# EAGLE design avr-grundschaltung (EAGLE 4.16)
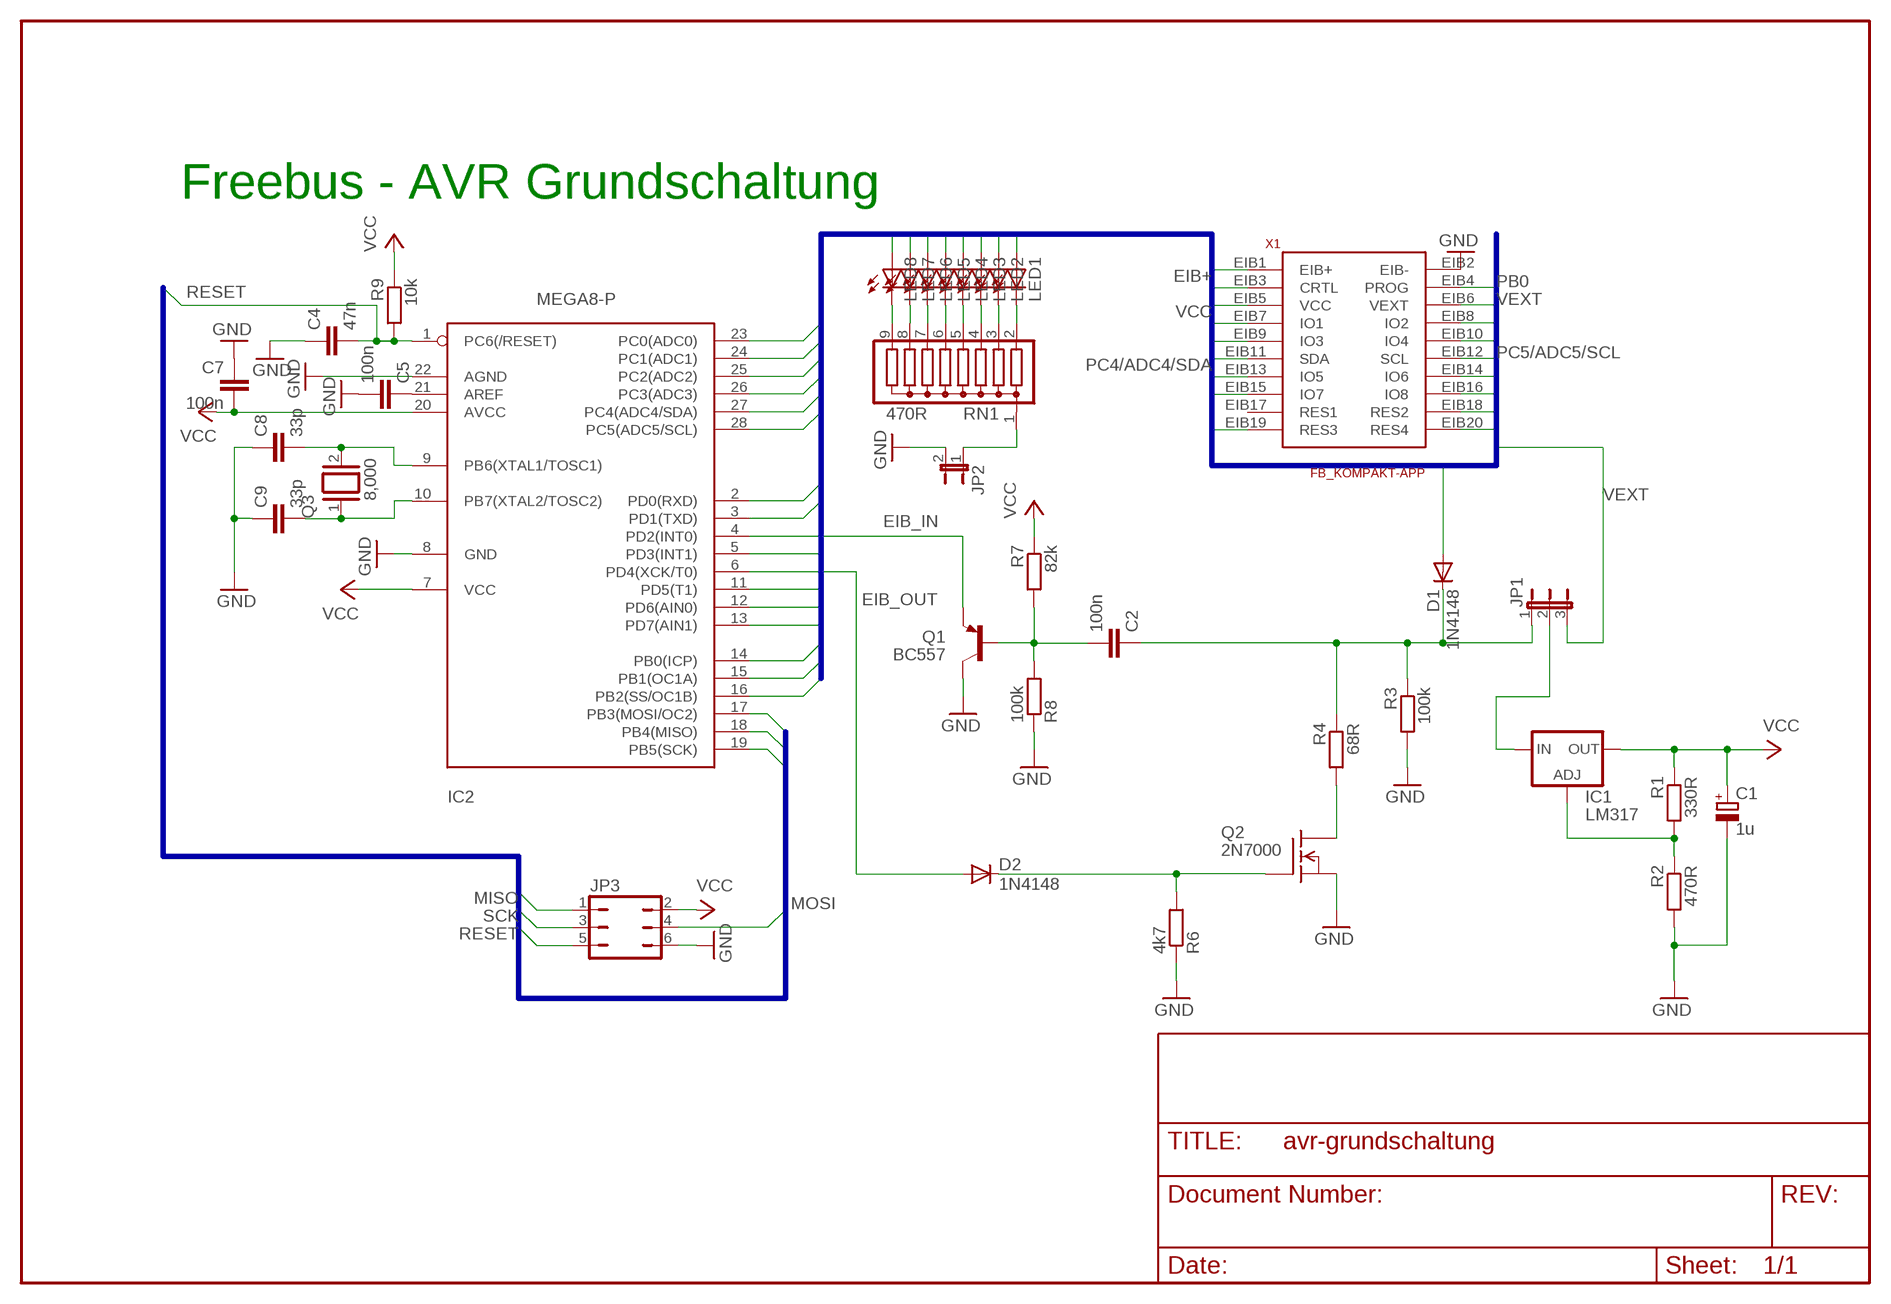
[diagram p0: schematic, sheet 1]

## Parts
C1  1u  CPOL-EUE2-5  [E2-5]
C2  100n  C-EU050-025X075  [C050-025X075]
C4  47n  C-EU050-024X044  [C050-024X044]
C5  100n  C-EU050-025X075  [C050-025X075]
C7  100n  C-EU050-025X075  [C050-025X075]
C8  33p  C-EU025-025X050  [C025-025X050]
C9  33p  C-EU025-025X050  [C025-025X050]
D1  1N4148  [DO35-10]
D2  1N4148  [DO35-10]
IC1  LM317  LM317L  [317L]
IC2  MEGA8-P  [DIL28-3]
JP1  JP2E  [JP2]
JP2  JP1E  [JP1]
JP3  JP3Q  [JP3Q]
LED1  LED3MM  [LED3MM]
LED2  LED3MM  [LED3MM]
LED3  LED3MM  [LED3MM]
LED4  LED3MM  [LED3MM]
LED5  LED3MM  [LED3MM]
LED6  LED3MM  [LED3MM]
LED7  LED3MM  [LED3MM]
LED8  LED3MM  [LED3MM]
Q1  BC557  [TO92]
Q2  2N7000  VN2222KM  [TO237]
Q3  8,000  XTAL/S  [QS]
R1  330R  R-EU_0207/10  [0207/10]
R2  470R  R-EU_0207/10  [0207/10]
R3  100k  R-EU_0207/10  [0207/10]
R4  68R  R-EU_0207/10  [0207/10]
R6  4k7  R-EU_0207/10  [0207/10]
R7  82k  R-EU_0207/10  [0207/10]
R8  100k  R-EU_0207/10  [0207/10]
R9  10k  R-EU_0207/10  [0207/10]
RN1  470R  G08R  [SIL9]
X1  FB_KOMPAKT-APP  [EIB_10X2_STECKER]

## Nets
EIB+: D1.A X1.EIB1(EIB+)
EIB_IN: IC2.4(PD2(INT0)) Q1.1(E)
EIB_OUT: D2.A IC2.6(PD4(XCK/T0))
GND: C1.- C4.1 C5.2 C7.1 C8.1 C9.1 IC2.8(GND) IC2.22(AGND) JP2.2 JP3.6 Q1.3(C) Q2.3(S) R2.2 R3.2 R6.1 R8.1 X1.EIB2(EIB-)
MISO: IC2.18(PB4(MISO)) JP3.1
MOSI: IC2.17(PB3(MOSI/OC2)) JP3.4
N$1: D2.C Q2.2(G) R6.2
N$2: IC1.1(ADJ) R1.2 R2.1
N$3 [supply]: C2.1 D1.C JP1.1 R3.1 R4.1
N$4: LED8.K(C) RN1.9
N$5 [supply]: Q2.1(D) R4.2
N$6 [supply]: IC1.3(IN) JP1.2
N$7 [supply]: C2.2 Q1.2(B) R7.2 R8.2
N$8: C8.2 IC2.9(PB6(XTAL1/TOSC1)) Q3.2
N$9: C9.2 IC2.10(PB7(XTAL2/TOSC2)) Q3.1
N$10: LED7.K(C) RN1.8
N$11: LED6.K(C) RN1.7
N$13: LED5.K(C) RN1.6
N$14: LED4.K(C) RN1.5
N$15: LED3.K(C) RN1.4
N$16: LED2.K(C) RN1.3
N$17: LED1.K(C) RN1.2
N$18: JP2.1 RN1.1
N$24: C5.1 IC2.21(AREF)
PB0: IC2.14(PB0(ICP)) X1.EIB4(PROG)
PB1/OC1A/PWM1: IC2.15(PB1(OC1A)) X1.EIB3(CRTL)
PB2/OC1B/PWM2: IC2.16(PB2(SS/OC1B)) X1.EIB19(RES3)
PC0/ADC0: IC2.23(PC0(ADC0)) X1.EIB18(RES2)
PC1/ADC1: IC2.24(PC1(ADC1)) X1.EIB20(RES4)
PC2/ADC2: IC2.25(PC2(ADC2)) LED7.A X1.EIB15(IO7)
PC3/ADC3: IC2.26(PC3(ADC3)) LED8.A X1.EIB16(IO8)
PC4/ADC4/SDA: IC2.27(PC4(ADC4/SDA)) X1.EIB11(SDA)
PC5/ADC5/SCL: IC2.28(PC5(ADC5/SCL)) X1.EIB12(SCL)
PD0/RXD: IC2.2(PD0(RXD)) LED1.A X1.EIB7(IO1)
PD1/TXD: IC2.3(PD1(TXD)) LED2.A X1.EIB8(IO2)
PD3/INT1: IC2.5(PD3(INT1)) LED3.A X1.EIB9(IO3)
PD5/T1: IC2.11(PD5(T1)) LED4.A X1.EIB10(IO4)
PD6/AIN0: IC2.12(PD6(AIN0)) LED5.A X1.EIB13(IO5)
PD7/AIN1: IC2.13(PD7(AIN1)) LED6.A X1.EIB14(IO6)
RESET: C4.2 IC2.1(PC6(/RESET)) JP3.5 R9.2
SCK: IC2.19(PB5(SCK)) JP3.3
VCC: C1.+ C7.2 IC1.2(OUT) IC2.7(VCC) IC2.20(AVCC) JP3.2 R1.1 R7.1 R9.1 X1.EIB5(VCC)
VEXT [supply]: JP1.3 X1.EIB6(VEXT)
Unconnected: X1.EIB17(RES1)

## Buses
PC0/ADC0,PC1/ADC1,PC2/ADC2,PC3/ADC3,PC4/ADC4/SDA,PC5/ADC5/SCL,PD0/RXD,PD1/TXD,EIB+,PB1/OC1A/PWM1,PB2/OC1B/PWM2,VEXT,PB0,VCC,PD3/INT1,PD5/T1,PD6/AIN0,PD7/AIN1
MOSI,MISO,SCK,RESET

## Notes on the sheet
- Freebus - AVR Grundschaltung

## Library data of the parts
C1 = rcl:CPOL-EU: POLARIZED CAPACITOR, European symbol
C2 C4 C5 C7-C9 = rcl:C-EU: CAPACITOR, European symbol
D1 D2 = diode:1N4148: DIODE high speed (Philips)
IC1 = v-reg:LM317L: VOLTAGE REGULATOR
IC2 = atmel:MEGA8-P: MICROCONTROLLER 8 Kbytes FLASH 1 kbytes SRAM 512 bytes EEPROM USART 4-channel 10 bit ADC 2-channel 8 bit ADC Source: avr.lbr
JP1 = jumper:JP2E: JUMPER
JP2 = jumper:JP1E: JUMPER
JP3 = jumper:JP3Q: JUMPER
LED1-LED8 = led:LED: LED OSRAM: - CHIPLED LG R971, LG N971, LY N971, LG Q971, LY Q971, LO R971, LY R971 LH N974, LH R974 LS Q976, LO Q976, LY Q976 LO Q996 - Hyper CHIPLED LW Q18S LB Q993, LB Q99A, LB R99A - SideLED LS A670, LO A670, LY A670, LG A670, LP A670 LB A673, LV A673, LT A673, LW A673 LH A674 LY A675 LS A676, LA A676, LO A676, LY A676, LW A676 LS A679, LY A679, LG A679 - Hyper Micro SIDELED® LS Y876, LA Y876, LO Y876, LY Y876 LT Y87S - SmartLED LW L88C, LW L88S LB L89C, LB L89S, LG L890 LS L89K, LO L89K, LY L89K LS L896, LA L896, LO L896, LY L896 - TOPLED LS T670, LO T670, LY T670, LG T670, LP T670 LSG T670, LSP T670, LSY T670, LOP T670, LYG T670 LG T671, LOG T671, LSG T671 LB T673, LV T673, LT T673, LW T673 LH T674 LS T676, LA T676, LO T676, LY T676, LB T676, LH T676, LSB T676, LW T676 LB T67C, LV T67C, LT T67C, LS T67K, LO T67K, LY T67K, LW E67C LS E67B, LA E67B, LO E67B, LY E67B, LB E67C, LV E67C, LT E67C LW T67C LS T679, LY T679, LG T679 LS T770, LO T770, LY T770, LG T770, LP T770 LB T773, LV T773, LT T773, LW T773 LH T774 LS E675, LA E675, LY E675, LS T675 LS T776, LA T776, LO T776, LY T776, LB T776 LHGB T686 LT T68C, LB T68C - Hyper Mini TOPLED® LB M676 - Mini TOPLED Santana® LG M470 LS M47K, LO M47K, LY M47K Source: http://www.osram.convergy.de - LUMILED® LXK2-PW12-R00, LXK2-PW12-S00, LXK2-PW14-U00, LXK2-PW14-V00 LXK2-PM12-R00, LXK2-PM12-S00, LXK2-PM14-U00 LXK2-PE12-Q00, LXK2-PE12-R00, LXK2-PE12-S00, LXK2-PE14-T00, LXK2-PE14-U00 LXK2-PB12-K00, LXK2-PB12-L00, LXK2-PB12-M00, LXK2-PB14-N00, LXK2-PB14-P00, LXK2-PB14-Q00 LXK2-PR12-L00, LXK2-PR12-M00, LXK2-PR14-Q00, LXK2-PR14-R00 LXK2-PD12-Q00, LXK2-PD12-R00, LXK2-PD12-S00 LXK2-PH12-R00, LXK2-PH12-S00 LXK2-PL12-P00, LXK2-PL12-Q00, LXK2-PL12-R00 Source: www.luxeon.com
Q1 = transistor-pnp:BC557: PNP Transistor
Q2 = transistor-fet:VN2222KM: N-Channel Enhancement MOSFET (VMOS); 60V; 0,5A; 7,5Ohm
Q3 = special:XTAL/S: CRYSTAL
R1-R4 R6-R9 = rcl:R-EU_: RESISTOR, European symbol
RN1 = resistor-sil:G08R: SIL RESISTOR
X1 = EIB_Freebus:FB_KOMPAKT: Steckverbinder für Controller <--> Anwendung Kompaktversion Vorteile: - Das Symbol im Schaltplan sieht so aus wie auf dem PCB - Vielleicht schneller zu überblicken, was an welchem Pin angeschlossen ist Nachteile: - Viele unnötige Leitungen im Schaltplan notwendig

## Net classes
0 default: width 0.406 mm
1 supply: width 0.406 mm

## Board
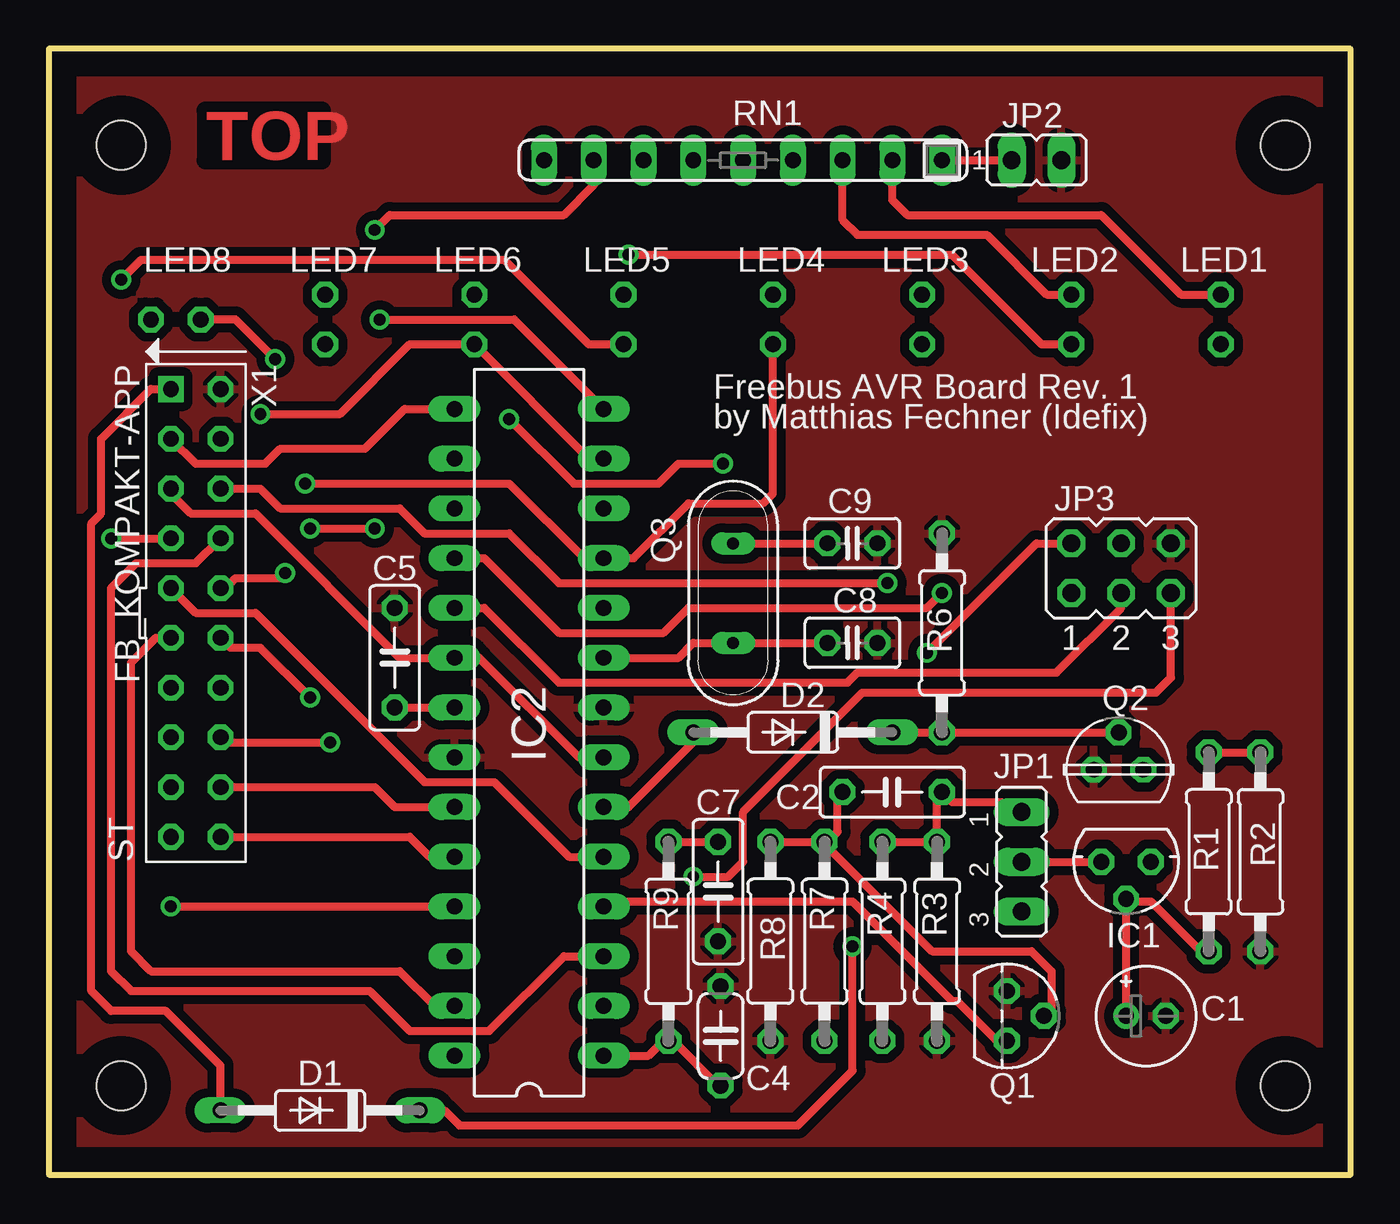
[diagram p1: board, top side]
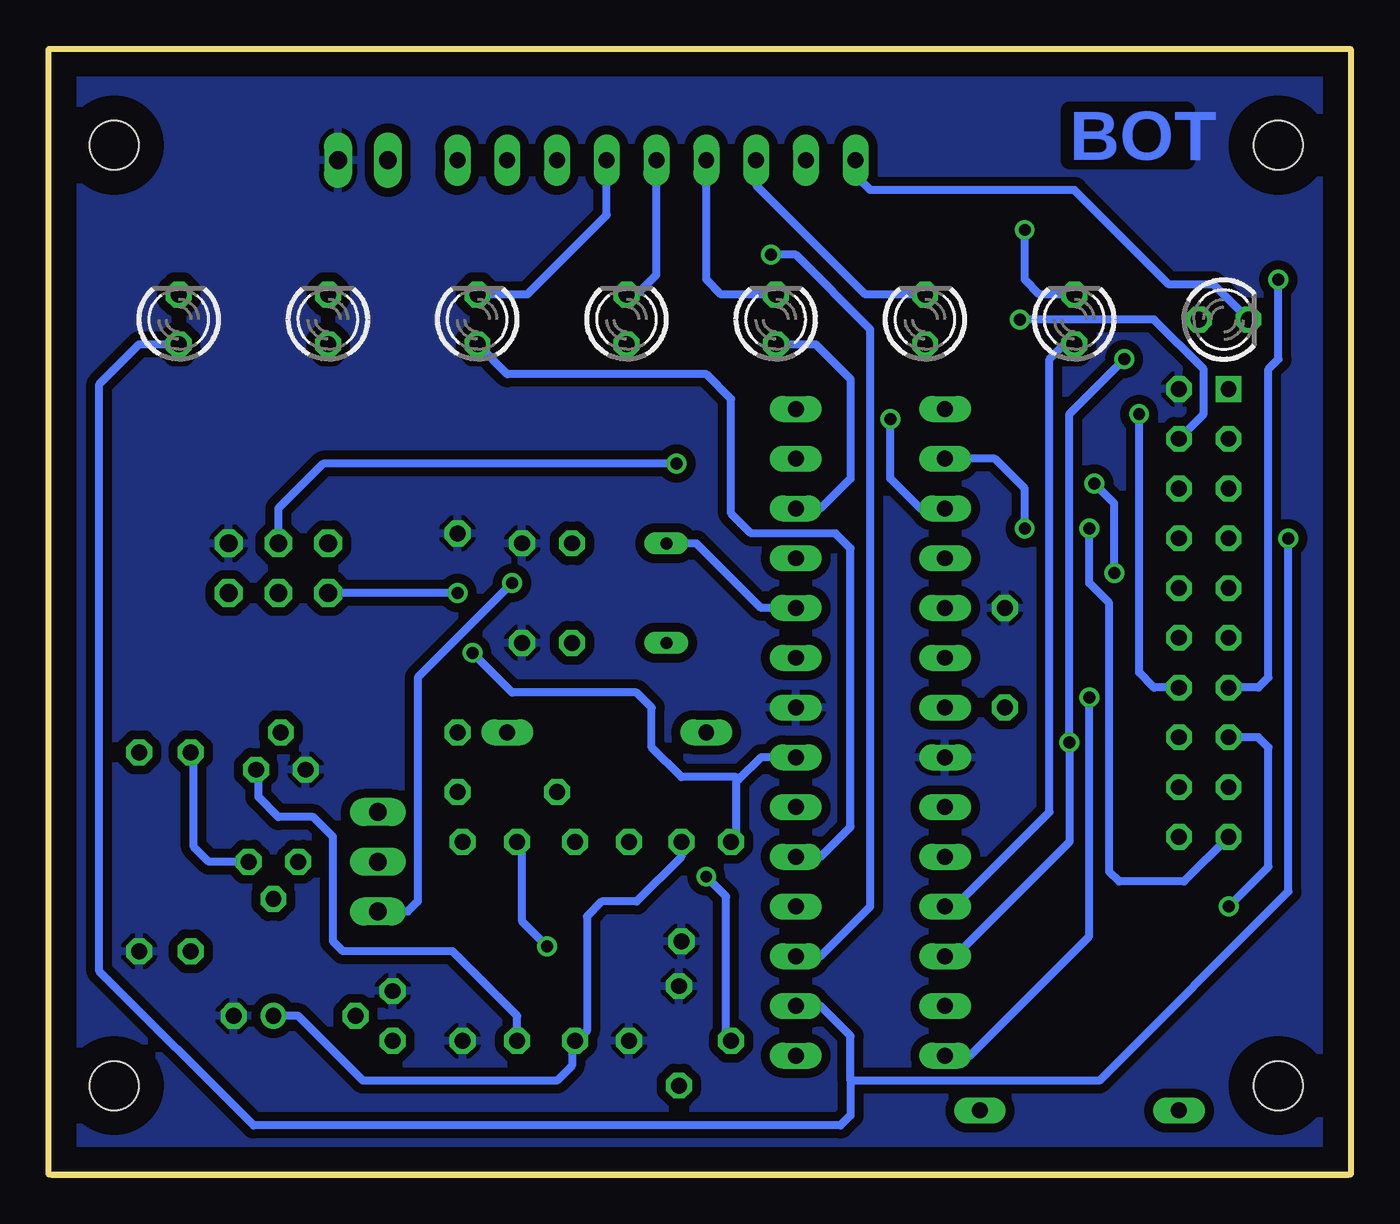
[diagram p2: board, bottom side, seen from below]

Size 66.45 x 57.47 mm. Coordinates in mm from the lower left corner, seen from the top.
Outline: 0,57.47 0,0 66.45,0 66.45,57.47 0,57.47
Copper layers (1*16): Top 0.035mm / dielectric 1.5mm / Bottom 0.035mm
Design rules "idefix-default": minimum track width 10mil, minimum drill 24mil, track to track 18mil, track to pad 12mil, pad to pad 8mil, via to via 50mil, smd to smd 8mil, copper to edge 50mil, drill to drill 50mil, minimum pad ring 10mil, minimum via ring 8mil, stop-mask expansion 4mil, vias tented up to drill 0mil, thermal gap 10mil
Holes 2.5 mm at 3.68,4.54 3.68,52.55 63.12,4.54 63.12,52.55
Milling: 4 lines

### Footprints (pad centres in the part's own frame; a part is rotated, then mirrored left to right if it is on the bottom)
E2-5 = drill 0.813 pad 1.27 round: + -1.016,0 | drill 0.813 pad 1.27 octagon: - 1.016,0
C050-025X075 = drill 0.813 octagon: 1 -2.54,0; 2 2.54,0
C050-024X044 = drill 0.813 octagon: 1 -2.54,0; 2 2.54,0
C025-025X050 = drill 0.813 octagon: 1 -1.27,0; 2 1.27,0
DO35-10 = drill 0.813 long: A 5.08,0; C -5.08,0
317L = drill 0.813 octagon: 1 -1.27,0; 2 0,1.905; 3 1.27,0
DIL28-3 = drill 0.813 long: 1 -16.51,-3.81; 2 -13.97,-3.81; 3 -11.43,-3.81; 4 -8.89,-3.81; 5 -6.35,-3.81; 6 -3.81,-3.81; 7 -1.27,-3.81; 8 1.27,-3.81; 9 3.81,-3.81; 10 6.35,-3.81; 11 8.89,-3.81; 12 11.43,-3.81; 13 13.97,-3.81; 14 16.51,-3.81; 15 16.51,3.81; 16 13.97,3.81; 17 11.43,3.81; 18 8.89,3.81; 19 6.35,3.81; 20 3.81,3.81; 21 1.27,3.81; 22 -1.27,3.81; 23 -3.81,3.81; 24 -6.35,3.81; 25 -8.89,3.81; 26 -11.43,3.81; 27 -13.97,3.81; 28 -16.51,3.81
JP2 = drill 0.914 long: 1 -2.54,0; 2 0,0; 3 2.54,0
JP1 = drill 0.914 long: 1 0,-1.27; 2 0,1.27
JP3Q = drill 0.914 octagon: 1 -2.54,-1.27; 2 -2.54,1.27; 3 0,-1.27; 4 0,1.27; 5 2.54,-1.27; 6 2.54,1.27
LED3MM = drill 0.813 octagon: A -1.27,0; K 1.27,0
TO92 = drill 0.813 octagon: 1 1.27,0; 2 0,1.905; 3 -1.27,0
TO237 = drill 0.813 octagon: 1 1.27,0; 2 0,1.905; 3 -1.27,0
QS = drill 0.61 long: 1 -2.54,0; 2 2.54,0
0207/10 = drill 0.813 octagon: 1 -5.08,0; 2 5.08,0
SIL9 = drill 0.813 long: 1 -10.16,0; 2 -7.62,0; 3 -5.08,0; 4 -2.54,0; 5 0,0; 6 2.54,0; 7 5.08,0; 8 7.62,0; 9 10.16,0
EIB_10X2_STECKER = drill 0.8 square: EIB1 -11.43,-1.27 | drill 0.8 octagon: EIB2 -11.43,1.27; EIB3 -8.89,-1.27; EIB4 -8.89,1.27; EIB5 -6.35,-1.27; EIB6 -6.35,1.27; EIB7 -3.81,-1.27; EIB8 -3.81,1.27; EIB9 -1.27,-1.27; EIB10 -1.27,1.27; EIB11 1.27,-1.27; EIB12 1.27,1.27; EIB13 3.81,-1.27; EIB14 3.81,1.27; EIB15 6.35,-1.27; EIB16 6.35,1.27; EIB17 8.89,-1.27; EIB18 8.89,1.27; EIB19 11.43,-1.27; EIB20 11.43,1.27

### Placement (x,y rotation side)
C1  56.01,8.1 0 top
C2  43.05,19.53 180 top
C4  34.29,7.08 270 top
C5  17.65,26.39 90 top
C7  34.16,14.45 90 top
C8  41.02,27.15 180 top
C9  41.02,32.23 180 top
D1  13.84,3.27 180 top
D2  37.97,22.58 180 top
IC1  54.99,15.97 180 top
IC2  24.51,22.58 90 top
JP1  49.66,15.97 270 top
JP2  50.42,51.79 270 top
JP3  54.74,30.96 0 top
LED1  59.82,43.66 90 bottom
LED2  52.2,43.66 90 bottom
LED3  44.58,43.66 90 bottom
LED4  36.96,43.66 90 bottom
LED5  29.34,43.66 90 bottom
LED6  21.72,43.66 90 bottom
LED7  14.1,43.66 90 bottom
LED8  6.48,43.66 0 bottom
Q1  48.89,8.1 270 top
Q2  54.61,20.67 0 top
Q3  34.92,29.69 270 top
R1  59.21,16.48 90 top
R2  61.85,16.48 270 top
R3  45.34,11.91 270 top
R4  42.54,11.91 270 top
R6  45.59,27.66 270 top
R7  39.6,11.91 90 top
R8  36.83,11.91 90 top
R9  31.62,11.91 270 top
RN1  35.43,51.79 180 top
X1  7.49,28.67 270 top

### Tracks (layer width: path | path; a pad name or v marks a point on that pad's centre or on a via)
EIB+
  Top 0.406: X1.EIB1 5.21,40.1 2.67,37.56 2.67,33.75 2.16,33.25 2.16,9.37 3.17,8.35 5.97,8.35 8.76,5.56 D1.A
EIB_IN
  Top 0.406: IC2.4 28.57,13.94 41.02,13.94 46.1,8.86 46.35,8.86 48.39,6.83 Q1.1
EIB_OUT
  Top 0.406: IC2.6 29.59,18.77 32.89,22.07 D2.A
GND
  pour Bottom: 0.38,57.02 66.01,57.02 66.01,0.43 0.38,0.43
  pour Top: 66.01,57.02 0.38,57.02 0.38,0.43 66.01,0.43
MISO  (via drill 0.61)
  Top 0.406: v45.59,29.69 44.83,28.93 32.64,28.93 31.37,27.66 26.03,27.66 22.22,31.47 IC2.18
  Bottom 0.406: v45.59,29.69 JP3.1
MOSI  (via drill 0.61)
  Top 0.406: v23.49,38.58 26.8,35.28 31.11,35.28 32.13,36.29 v34.42,36.29
  Bottom 0.406: v23.49,38.58 23.49,35.53 21.97,34.01 IC2.17 | v34.42,36.29 52.45,36.29 54.74,34.01 JP3.4
N$1
  Top 0.406: D2.C R6.2 Q2.2
N$2
  Top 0.406: R1.2 R2.1
  Bottom 0.406: IC1.1 58.29,15.97 59.05,16.74 59.05,21.56 R1.2
N$3  (via drill 0.61)
  Top 0.406: JP1.1 49.15,18.51 48.64,19.02 46.1,19.02 C2.1 45.34,19.28 R3.1 R4.1 | v41.02,11.66 41.02,5.31 38.23,2.51 20.95,2.51 20.19,3.27 D1.C
  Bottom 0.406: v41.02,11.66 42.29,12.93 42.29,16.74 R4.1
N$4
  Bottom 0.406: LED8.K 6.98,45.44 9.27,45.44 14.1,50.26 24.51,50.26 25.27,51.03 RN1.9
N$5
  Bottom 0.406: R4.2 42.54,8.1 45.85,11.4 51.43,11.4 51.94,11.91 51.94,17.24 52.96,18.26 54.74,18.26 55.75,19.28 55.75,20.55 Q2.1
N$6
  Top 0.406: JP1.2 IC1.3
N$7
  Top 0.406: R8.2 R7.2 39.75,16.99 | Q1.2 51.18,8.1 51.18,10.39 50.16,11.4 45.08,11.4 39.75,16.74 39.75,16.99 | 39.75,16.99 40.26,17.5 40.26,19.28 C2.2
N$8
  Top 0.406: C8.2 Q3.2 32.89,27.15 32.13,26.39 IC2.9
N$9
  Top 0.406: Q3.1 C9.2
  Bottom 0.406: IC2.10 30.1,28.93 33.4,32.23 Q3.1
N$10  (via drill 0.61)
  Top 0.406: v16.64,48.23 17.4,48.99 26.29,48.99 27.81,50.52 RN1.8
  Bottom 0.406: v16.64,48.23 16.64,45.69 15.87,44.93 LED7.K
N$11
  Bottom 0.406: LED6.K 24.76,44.93 30.35,50.52 RN1.7
N$13
  Bottom 0.406: LED5.K 32.13,44.93 32.89,45.69 RN1.6
N$14
  Bottom 0.406: LED4.K 36.45,44.93 35.43,45.95 RN1.5
N$15
  Bottom 0.406: LED3.K 42.04,44.93 37.97,48.99 RN1.4
N$16
  Top 0.406: RN1.3 40.51,48.74 41.27,47.98 47.88,47.98 50.93,44.93 LED2.K
N$17
  Top 0.406: RN1.2 43.05,49.76 43.81,48.99 53.72,48.99 57.78,44.93 LED1.K
N$18
  Top 0.406: RN1.1 JP2.1
N$24
  Top 0.406: C5.1 IC2.21
PB0  (via drill 0.61)
  Top 0.406: v16.89,43.66 23.75,43.66 IC2.14
  Bottom 0.406: X1.EIB4 7.49,38.83 7.49,41.12 10.03,43.66 v16.89,43.66
PB1/OC1A/PWM1
  Top 0.406: X1.EIB3 7.49,36.29 11.05,36.29 11.81,37.06 16.13,37.06 18.16,39.09 IC2.15
PB2/OC1B/PWM2  (via drill 0.61)
  Top 0.406: v13.33,32.99 v16.64,32.99
  Bottom 0.406: v13.33,32.99 13.33,30.2 12.32,29.18 12.32,15.47 11.81,14.96 8.51,14.96 X1.EIB19 | v16.64,32.99 16.64,35.02 18.16,36.55 IC2.16
PC0/ADC0
  Top 0.406: X1.EIB18 16.64,19.78 17.65,18.77 IC2.23
PC1/ADC1
  Top 0.406: X1.EIB20 18.41,17.24 19.43,16.23 IC2.24
PC2/ADC2  (via drill 0.61)
  Top 0.406: v6.22,13.69 IC2.25
  Bottom 0.406: v6.22,13.69 4.19,15.72 4.19,21.82 4.7,22.32 X1.EIB15 | LED7.A 14.6,42.39 15.37,41.63 15.37,18.51 20.19,13.69 IC2.25
PC3/ADC3  (via drill 0.61)
  Top 0.406: X1.EIB16 9.02,22.07 v14.35,22.07 | v11.56,41.63 9.52,43.66 LED8.A
  Bottom 0.406: IC2.26 20.19,11.15 14.35,16.99 v14.35,22.07 14.35,38.83 v11.56,41.63
PC4/ADC4/SDA
  Top 0.406: X1.EIB11 5.46,27.4 4.19,26.13 4.19,11.4 5.21,10.39 17.91,10.39 19.68,8.61 IC2.27
PC5/ADC5/SCL  (via drill 0.61)
  Top 0.406: X1.EIB12 9.27,26.9 10.79,26.9 v13.33,24.36
  Bottom 0.406: v13.33,24.36 13.33,12.16 19.43,6.07 IC2.28
PD0/RXD  (via drill 0.61)
  Top 0.406: v3.17,32.48 X1.EIB7
  Bottom 0.406: v3.17,32.48 3.17,14.45 12.83,4.8 25.53,4.8 | 25.53,4.8 25.53,7.08 27.05,8.61 IC2.2 | 25.53,4.8 25.53,3.02 26.03,2.51 56.01,2.51 63.88,10.39 63.88,40.36 61.85,42.39 LED1.A
PD1/TXD  (via drill 0.61)
  Top 0.406: X1.EIB8 7.49,31.21 4.44,31.21 3.17,29.94 3.17,10.39 4.19,9.37 16.38,9.37 18.41,7.34 22.48,7.34 26.29,11.15 IC2.3 | v29.59,46.96 46.1,46.96 50.67,42.39 LED2.A
  Bottom 0.406: v29.59,46.96 28.32,46.96 24.51,43.15 24.51,13.69 27.05,11.15 IC2.3
PD3/INT1
  Top 0.406: X1.EIB9 7.49,28.67 10.54,28.67 19.18,20.04 22.73,20.04 26.54,16.23 IC2.5
  Bottom 0.406: LED3.A 43.05,40.87 32.89,40.87 31.62,39.6 31.62,33.75 30.61,32.74 26.29,32.74 25.53,31.98 25.53,17.75 27.05,16.23 IC2.5
PD5/T1  (via drill 0.61)
  Top 0.406: v12.06,30.71 11.81,30.45 9.52,30.45 9.02,29.94 X1.EIB10 | v13.08,35.28 23.49,35.28 27.3,31.47 IC2.11 29.84,31.47 32.64,34.26 36.45,34.26 36.96,34.77 LED4.A
  Bottom 0.406: v12.06,30.71 12.06,34.26 v13.08,35.28
PD6/AIN0  (via drill 0.61)
  Top 0.406: v3.68,45.69 4.7,46.71 23.24,46.71 27.56,42.39 LED5.A
  Bottom 0.406: v3.68,45.69 3.68,41.63 4.19,41.12 4.19,25.37 4.7,24.86 X1.EIB13 | IC2.12 27.05,34.01 25.53,35.53 25.53,40.61 27.3,42.39 LED5.A
PD7/AIN1  (via drill 0.61)
  Top 0.406: v10.79,38.83 14.86,38.83 18.41,42.39 LED6.A 27.56,36.55 IC2.13
  Bottom 0.406: v10.79,38.83 10.79,25.63 10.03,24.86 X1.EIB14
RESET  (via drill 0.61)
  Top 0.406: IC2.1 30.61,6.07 31.37,6.83 R9.2 31.88,6.83 34.16,4.54 C4.2 | v32.89,15.21 34.67,15.21 35.43,15.97 35.43,18.51 41.53,24.61 56.51,24.61 57.28,25.37 JP3.5
  Bottom 0.406: v32.89,15.21 31.88,14.2 31.88,7.08 R9.2
SCK
  Top 0.406: IC2.19 22.22,28.93 26.03,25.12 40.77,25.12 41.27,25.63 51.43,25.63 54.74,28.93 JP3.3
VCC  (via drill 0.61)
  Top 0.406: X1.EIB5 6.22,34.77 7.24,33.75 10.54,33.75 17.91,26.39 IC2.20 21.97,26.39 27.05,21.31 IC2.7 | C1.+ 54.99,13.94 | R9.1 C7.2 | v44.83,26.64 50.42,32.23 JP3.2 | R1.1 58.8,11.4 56.26,13.94 54.99,13.94 | 54.99,13.94 IC1.2
  Bottom 0.406: C7.2 34.16,16.23 36.45,13.94 38.23,13.94 38.99,13.18 38.99,7.34 39.5,6.83 R7.1 39.75,6.83 39.75,5.56 40.51,4.8 50.42,4.8 53.72,8.1 C1.+ | 31.24,20.16 30.1,21.31 IC2.7 | 31.24,20.16 31.37,20.04 31.37,17.24 R9.1 | v44.83,26.64 42.8,24.61 36.45,24.61 35.69,23.85 35.69,21.82 34.16,20.29 31.37,20.29 31.24,20.16
VEXT  (via drill 0.61)
  Top 0.406: v42.8,30.2 26.03,30.2 23.49,32.74 19.18,32.74 17.91,34.01 11.81,34.01 10.79,35.02 X1.EIB6
  Bottom 0.406: v42.8,30.2 47.62,25.37 47.62,13.94 48.13,13.43 JP1.3

### Text on the board
Top: TOP
Bottom: BOT
tNames: Freebus AVR Board Rev. 1 | by Matthias Fechner (Idefix)